# Altium schematic sheet Termočlánok.SchDoc
size A4
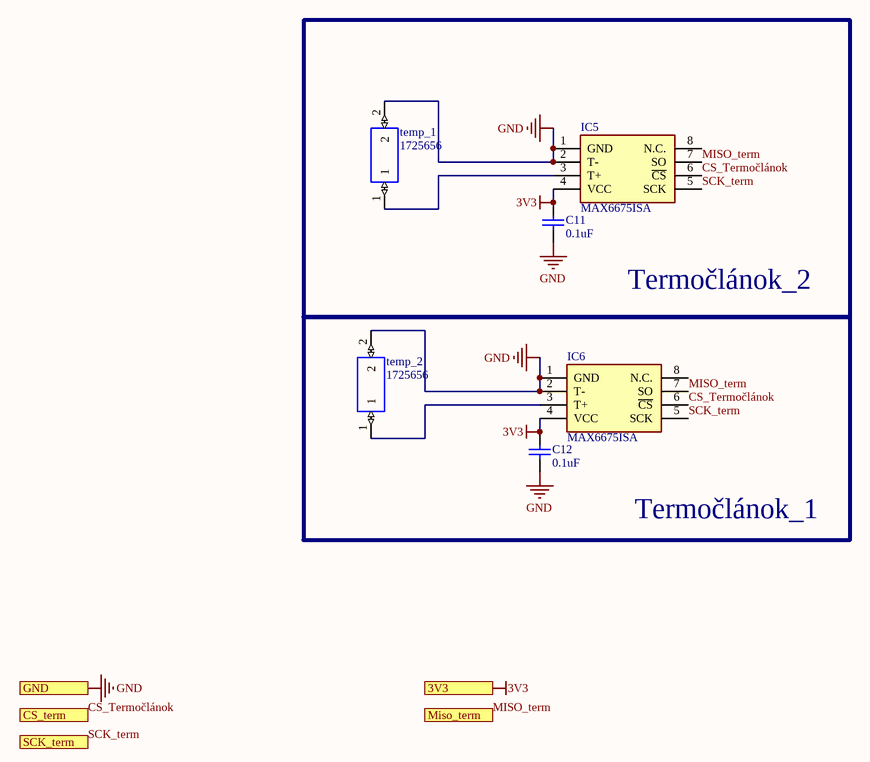
[diagram p0: Termočlánok.SchDoc]

## Parts
C11  0.1uF  [1608[0603]]
C12  0.1uF  [1608[0603]]
IC5  MAX6675ISA  [SOIC127P600X175-8N]
IC6  MAX6675ISA  [SOIC127P600X175-8N]
temp_1  1725656  [1725656]
temp_2  1725656  [1725656]

## Blocks framed on the sheet
Termočlánok_2: C11 IC5 temp_1
Termočlánok_1: C12 IC6 temp_2

## Ports
3V3 (in), CS_term (in), GND (in), Miso_term (in), SCK_term (in)

## Nets
3V3: C11.2 C12.2 IC5.4(VCC) IC6.4(VCC) ; port 3V3
GND: C11.1 C12.1 IC5.1(GND) IC5.2(T-) IC6.1(GND) IC6.2(T-) temp_1.2 temp_2.2 ; port GND
CS_Termočlánok: IC5.6(~{CS}) IC6.6(~{CS}) ; port CS_term
MISO_term: IC5.7(SO) IC6.7(SO) ; port Miso_term
SCK_term: IC5.5(SCK) IC6.5(SCK) ; port SCK_term
NetIC5_3: IC5.3(T+) temp_1.1
NetIC6_3: IC6.3(T+) temp_2.1

Not connected (* = marked no-connect by the designer): IC5 8(N.C.); IC6 8(N.C.)

## Library data of the parts
C11 C12 = Cap Semi: Capacitor (Semiconductor SIM Model); Published: 8-Jun-2000; LatestRevisionDate: 29-May-2009; LatestRevisionNote: IPC-7351 Footprint Added.; PackageReference: C1206; Publisher: Altium Limited; PackageDescription: Chip Capacitor; Value: 0.1uF
IC5 IC6 = MAX6675ISA: Integrated Circuit; Manufacturer_Name: Maxim Integrated; Datasheet Link: http://datasheets.maximintegrated.com/en/ds/MAX6675.pdf; Height: 1.75mm; Manufacturer_Part_Number: MAX6675ISA; Mouser Part Number: N/A; Mouser Price/Stock: https://www.mouser.com/Search/Refine.aspx?Keyword=N%2FA
temp_1 temp_2 = 1725656: 2 way PCB vertical mount terminal,2.54mm 2 way PCB vertical mount terminal,2.54mm; Manufacturer_Name: Phoenix Contact; Allied_Number: 70054335; Geometry.Height: 8mm; Manufacturer_Part_Number: 1725656; RS Part Number: 2204260; RS Price/Stock: http://uk.rs-online.com/web/p/products/2204260; Allied Price/Stock: http://www.alliedelec.com/phoenix-contact-1725656/70054335/; Arrow Part Number: 1725656; Arrow Price/Stock: https://www.arrow.com/en/products/1725656/phoenix-contact; Datasheet Link: https://www.phoenixcontact.com/online/portal/gb?uri=pxc-oc-itemdetail:pid=1725656&library=gben&tab=1